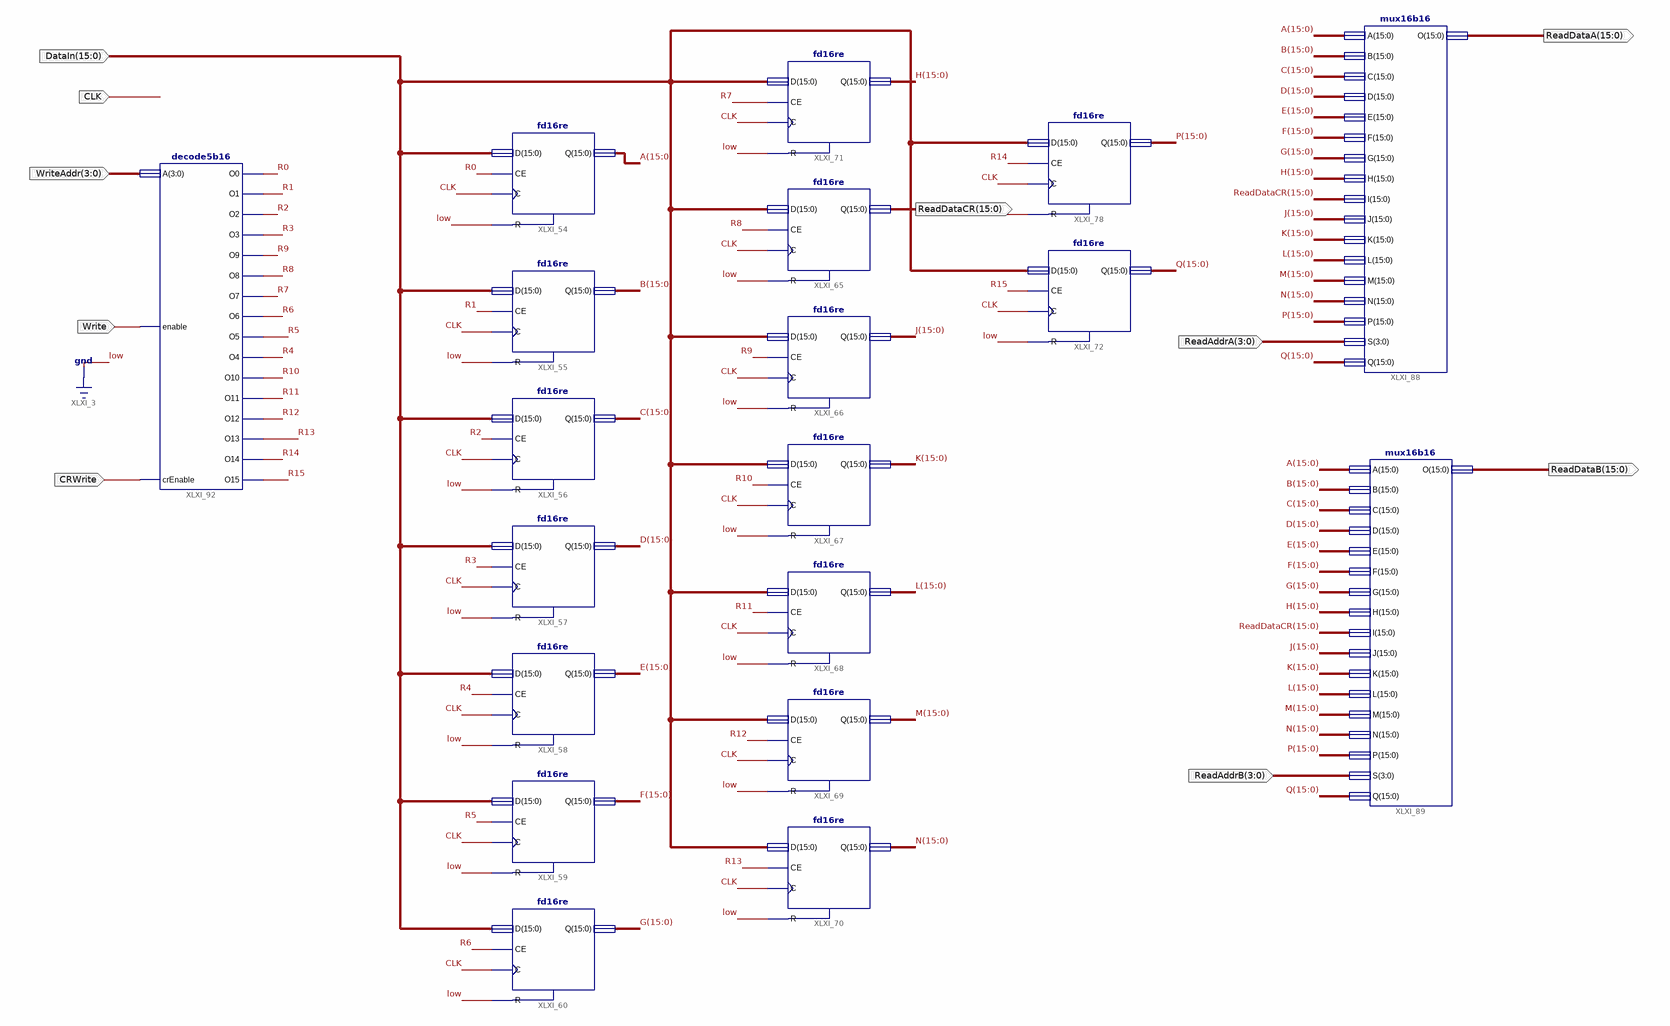
[diagram p0: schematic sheet 1]
// Xilinx ISE schematic regFile16b16.sch (spartan3adsp) as structural Verilog: 19 symbols, 10 ports
module regFile16b16 (
  input  CLK,
  input  [15:0] DataIn,
  input  [3:0] WriteAddr,
  input  [3:0] ReadAddrA,
  input  [3:0] ReadAddrB,
  input  CRWrite,
  input  Write,
  output [15:0] ReadDataA,
  output [15:0] ReadDataB,
  output [15:0] ReadDataCR
);

  wire R0, R1, R2, R3, R4, R5, R6, R7, R8, R9, R10, R11, R12, R13, R14, R15;
  wire [15:0] A, B, C, D, E, F, G, H, J, K, L, M, N, P, Q;

  fd16re XLXI_65 (.C(CLK), .CE(R8), .D(DataIn), .R(1'b0), .Q(ReadDataCR));
  fd16re XLXI_66 (.C(CLK), .CE(R9), .D(DataIn), .R(1'b0), .Q(J));
  fd16re XLXI_67 (.C(CLK), .CE(R10), .D(DataIn), .R(1'b0), .Q(K));
  fd16re XLXI_68 (.C(CLK), .CE(R11), .D(DataIn), .R(1'b0), .Q(L));
  fd16re XLXI_69 (.C(CLK), .CE(R12), .D(DataIn), .R(1'b0), .Q(M));
  fd16re XLXI_70 (.C(CLK), .CE(R13), .D(DataIn), .R(1'b0), .Q(N));
  fd16re XLXI_71 (.C(CLK), .CE(R7), .D(DataIn), .R(1'b0), .Q(H));
  fd16re XLXI_72 (.C(CLK), .CE(R15), .D(DataIn), .R(1'b0), .Q(Q));
  fd16re XLXI_78 (.C(CLK), .CE(R14), .D(DataIn), .R(1'b0), .Q(P));
  fd16re XLXI_55 (.C(CLK), .CE(R1), .D(DataIn), .R(1'b0), .Q(B));
  fd16re XLXI_56 (.C(CLK), .CE(R2), .D(DataIn), .R(1'b0), .Q(C));
  fd16re XLXI_57 (.C(CLK), .CE(R3), .D(DataIn), .R(1'b0), .Q(D));
  fd16re XLXI_58 (.C(CLK), .CE(R4), .D(DataIn), .R(1'b0), .Q(E));
  fd16re XLXI_59 (.C(CLK), .CE(R5), .D(DataIn), .R(1'b0), .Q(F));
  fd16re XLXI_60 (.C(CLK), .CE(R6), .D(DataIn), .R(1'b0), .Q(G));
  fd16re XLXI_54 (.C(CLK), .CE(R0), .D(DataIn), .R(1'b0), .Q(A));
  mux16b16 XLXI_88 (
    .A(A), .B(B), .C(C), .D(D), .E(E), .F(F), .G(G), .H(H), .I(ReadDataCR), .J(J), .K(K), .L(L), .M(M),
    .N(N), .P(P), .S(ReadAddrA), .Q(Q), .O(ReadDataA));
  mux16b16 XLXI_89 (
    .A(A), .B(B), .C(C), .D(D), .E(E), .F(F), .G(G), .H(H), .I(ReadDataCR), .J(J), .K(K), .L(L), .M(M),
    .N(N), .P(P), .S(ReadAddrB), .Q(Q), .O(ReadDataB));
  decode5b16 XLXI_92 (
    .A(WriteAddr), .enable(Write), .crEnable(CRWrite), .O0(R0), .O1(R1), .O2(R2), .O3(R3), .O9(R9), .O8(R8),
    .O7(R7), .O6(R6), .O5(R5), .O4(R4), .O10(R10), .O11(R11), .O12(R12), .O13(R13), .O14(R14), .O15(R15));
endmodule
